# EAGLE schematic p1 (EAGLE 7.6.0)
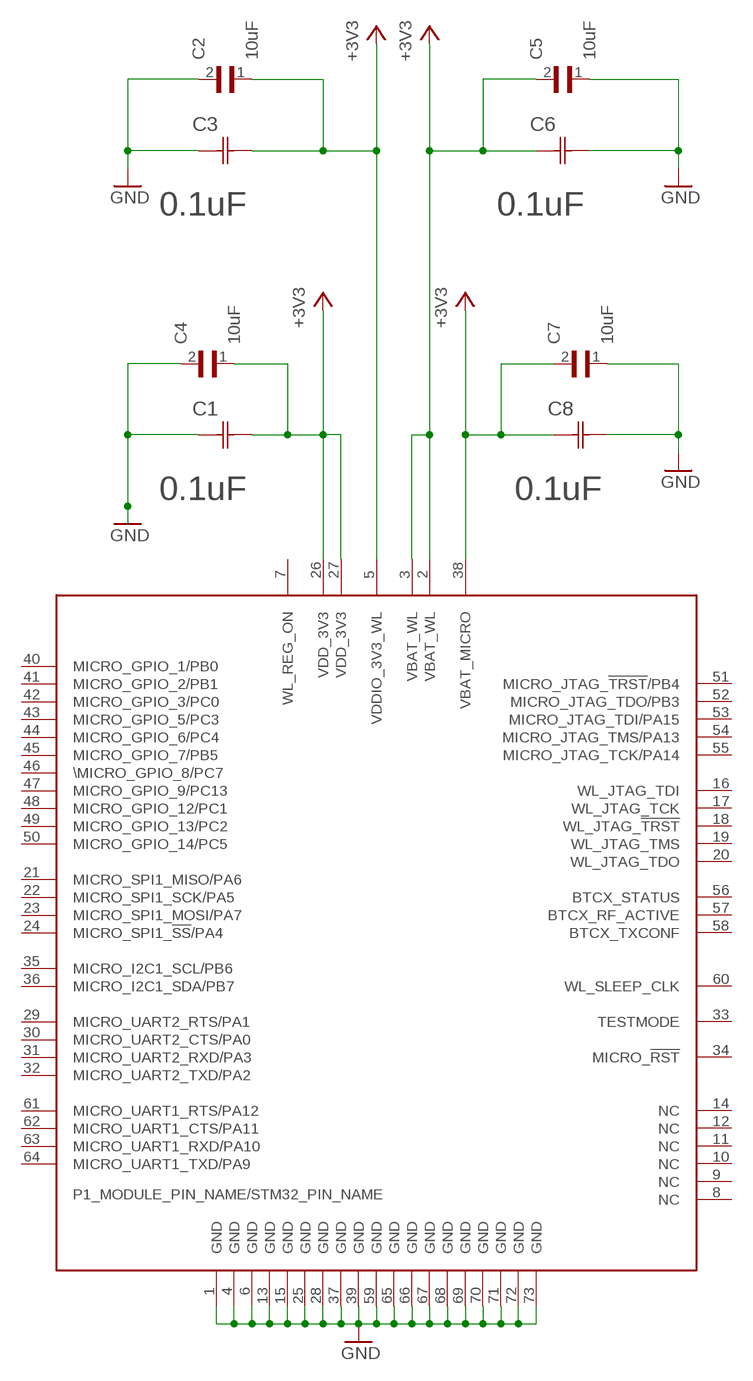
[diagram p0: schematic, sheet 1]

## Parts
C1  0.1uF  C0603X104K5RACTU  [CAPC1608X85N]
C2  10uF  WCAP-CSGP_0402  [WCAP-CSGP_0402]
C3  0.1uF  C0603X104K5RACTU  [CAPC1608X85N]
C4  10uF  WCAP-CSGP_0402  [WCAP-CSGP_0402]
C5  10uF  WCAP-CSGP_0402  [WCAP-CSGP_0402]
C6  0.1uF  C0603X104K5RACTU  [CAPC1608X85N]
C7  10uF  WCAP-CSGP_0402  [WCAP-CSGP_0402]
C8  0.1uF  C0603X104K5RACTU  [CAPC1608X85N]
U$1  WM-N-BM-14  [WM-N-BM-14]

## Nets
+3V3: C1.2(C2) C2.1 C3.2(C2) C4.1 C5.2 C6.1(C1) C7.2 C8.1(C1) U$1.2(VBAT_WL) U$1.3(VBAT_WL) U$1.5(VDDIO_3V3_WL) U$1.26(VDD_3V3) U$1.27(VDD_3V3) U$1.38(VBAT_MICRO)
GND: C1.1(C1) C2.2 C3.1(C1) C4.2 C5.1 C6.2(C2) C7.1 C8.2(C2)
N$1: U$1.1(GND) U$1.4(GND) U$1.6(GND) U$1.13(GND) U$1.15(GND) U$1.25(GND) U$1.28(GND) U$1.37(GND) U$1.39(GND) U$1.59(GND) U$1.65(GND) U$1.66(GND) U$1.67(GND) U$1.68(GND) U$1.69(GND) U$1.70(GND) U$1.71(GND) U$1.72(GND) U$1.73(GND) ; supply symbol labelled GND
Unconnected: U$1.7(WL_REG_ON) U$1.8(NC) U$1.9(NC) U$1.10(NC) U$1.11(NC) U$1.12(NC) U$1.14(NC) U$1.16(WL_JTAG_TDI) U$1.17(WL_JTAG_TCK) U$1.18(WL_JTAG_!TRST!) U$1.19(WL_JTAG_TMS) U$1.20(WL_JTAG_TDO) U$1.21(MICRO_SPI1_MISO/PA6) U$1.22(MICRO_SPI1_SCK/PA5) U$1.23(MICRO_SPI1_MOSI/PA7) U$1.24(MICRO_SPI1_!SS!/PA4) U$1.29(MICRO_UART2_RTS/PA1) U$1.30(MICRO_UART2_CTS/PA0) U$1.31(MICRO_UART2_RXD/PA3) U$1.32(MICRO_UART2_TXD/PA2) U$1.33(TESTMODE) U$1.34(MICRO_!RST!) U$1.35(MICRO_I2C1_SCL/PB6) U$1.36(MICRO_I2C1_SDA/PB7) U$1.40(MICRO_GPIO_1/PB0) U$1.41(MICRO_GPIO_2/PB1) U$1.42(MICRO_GPIO_3/PC0) U$1.43(MICRO_GPIO_5/PC3) U$1.44(MICRO_GPIO_6/PC4) U$1.45(MICRO_GPIO_7/PB5) U$1.46(\MICRO_GPIO_8/PC7) U$1.47(MICRO_GPIO_9/PC13) U$1.48(MICRO_GPIO_12/PC1) U$1.49(MICRO_GPIO_13/PC2) U$1.50(MICRO_GPIO_14/PC5) U$1.51(MICRO_JTAG_!TRST!/PB4) U$1.52(MICRO_JTAG_TDO/PB3) U$1.53(MICRO_JTAG_TDI/PA15) U$1.54(MICRO_JTAG_TMS/PA13) U$1.55(MICRO_JTAG_TCK/PA14) U$1.56(BTCX_STATUS) U$1.57(BTCX_RF_ACTIVE) U$1.58(BTCX_TXCONF) U$1.60(WL_SLEEP_CLK) U$1.61(MICRO_UART1_RTS/PA12) U$1.62(MICRO_UART1_CTS/PA11) U$1.63(MICRO_UART1_RXD/PA10) U$1.64(MICRO_UART1_TXD/PA9)

## Library data of the parts
C1 C3 C6 C8 = Kemet_By_element14_Batch_1:C0603X104K5RACTU: CAPACITOR, 0603; MPN: C0603X104K5RACTU; OC_FARNELL: 1414028; OC_NEWARK: 94M5632; SUPPLIER: Kemet; TOLERANCE: ±10%; VALUE: 100nF; VOLTAGERATING: 50V
C2 C4 C5 C7 = Wurth_Elektronik_Passive_Capacitors_rev15a:WCAP-CSGP: WCAP-CSGP Ceramic Capacitors Characteristics Multilayer Ceramic Chip Capacitor Recommended soldering:Reflow, for 0603 and 0805 wave soldering is also allowed Operating temperature:-55 °C to +125 °C; Ceramic characteristics: Class I - NPO ; Class II -X7R, X5R High performance ceramic High capacitance stability Minimal aging Termination:Cu/Ni/Sn <http://katalog.we-online.de/media/images/eisos/WCAP-CSGP_pf2.jpg> Details see: http://katalog.we-online.de/en/pbs/WCAP-CSGP/?m Created: 2015-01-28 2015 (C) Wurth Elektronik
U$1 = Spark:WM-N-BM-14